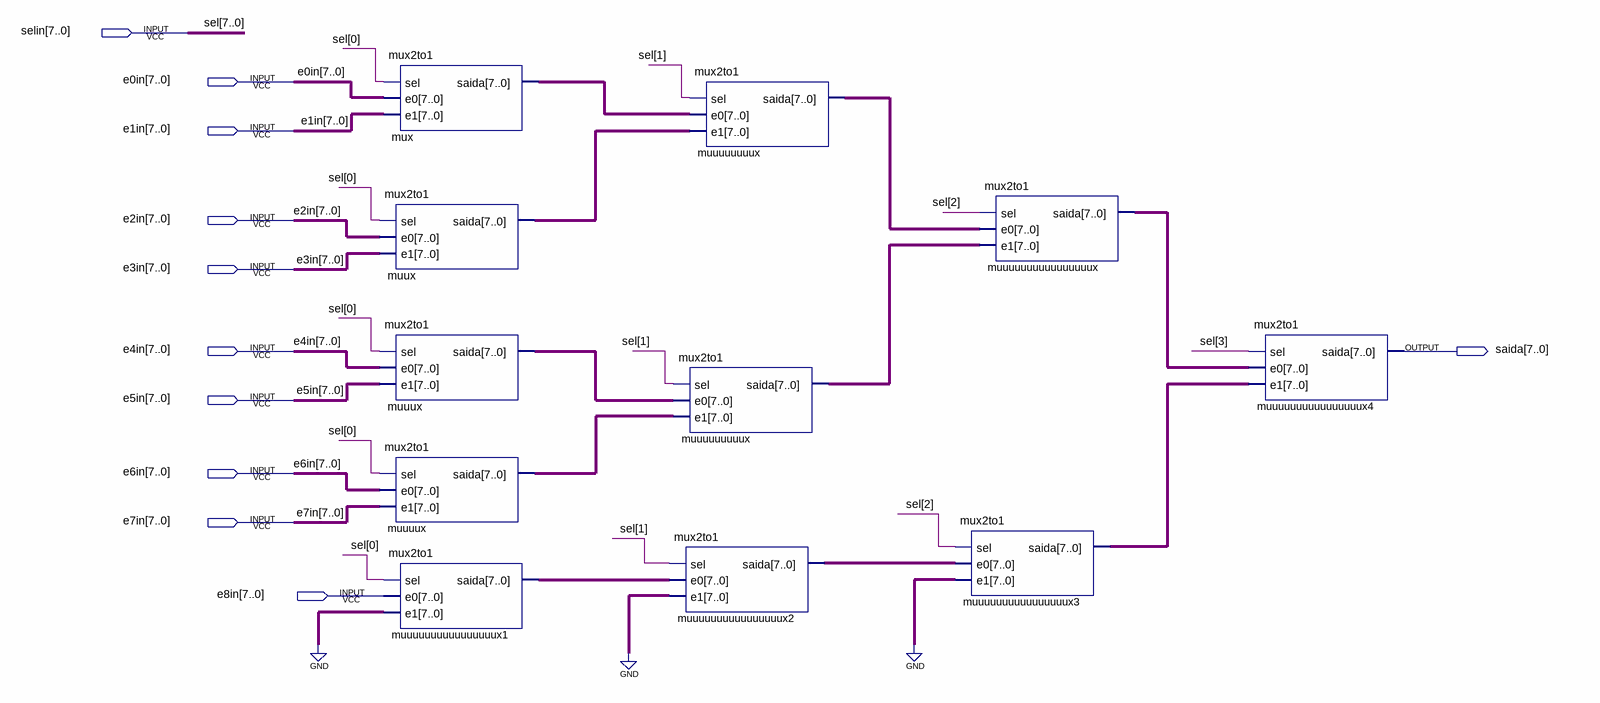
[diagram p0: schematic sheet]
// Quartus schematic memoria.bdf as structural Verilog: 11 symbols, 11 pins
module memoria (
  input  [7:0] selin,
  input  [7:0] e0in,
  input  [7:0] e1in,
  input  [7:0] e2in,
  input  [7:0] e3in,
  input  [7:0] e4in,
  input  [7:0] e5in,
  input  [7:0] e6in,
  input  [7:0] e7in,
  input  [7:0] e8in,
  output [7:0] saida
);

  wire [7:0] muuuuuuuuuuuuuuuux1_saida, muuuuuuuuuuuuuuuux2_saida, muuuuuuuuuuuuuuuux3_saida,
       muuuuuuuuuuuuuuuux_saida, muuuuuuuuux_saida, muuuuuuuux_saida, muuuux_saida, muuux_saida, muux_saida,
       mux_saida;

  mux2to1 mux (.sel(selin[0]), .e0(e0in), .e1(e1in), .saida(mux_saida));
  mux2to1 muux (.sel(selin[0]), .e0(e2in), .e1(e3in), .saida(muux_saida));
  mux2to1 muuux (.sel(selin[0]), .e0(e4in), .e1(e5in), .saida(muuux_saida));
  mux2to1 muuuux (.sel(selin[0]), .e0(e6in), .e1(e7in), .saida(muuuux_saida));
  mux2to1 muuuuuuuuuuuuuuuux1 (.sel(selin[0]), .e0(e8in), .e1({8{1'b0}}), .saida(muuuuuuuuuuuuuuuux1_saida));
  mux2to1 muuuuuuuux (.sel(selin[1]), .e0(mux_saida), .e1(muux_saida), .saida(muuuuuuuux_saida));
  mux2to1 muuuuuuuuux (.sel(selin[1]), .e0(muuux_saida), .e1(muuuux_saida), .saida(muuuuuuuuux_saida));
  mux2to1 muuuuuuuuuuuuuuuux2 (
    .sel(selin[1]), .e0(muuuuuuuuuuuuuuuux1_saida), .e1({8{1'b0}}), .saida(muuuuuuuuuuuuuuuux2_saida));
  mux2to1 muuuuuuuuuuuuuuuux (
    .sel(selin[2]), .e0(muuuuuuuux_saida), .e1(muuuuuuuuux_saida), .saida(muuuuuuuuuuuuuuuux_saida));
  mux2to1 muuuuuuuuuuuuuuuux3 (
    .sel(selin[2]), .e0(muuuuuuuuuuuuuuuux2_saida), .e1({8{1'b0}}), .saida(muuuuuuuuuuuuuuuux3_saida));
  mux2to1 muuuuuuuuuuuuuuuux4 (
    .sel(selin[3]), .e0(muuuuuuuuuuuuuuuux_saida), .e1(muuuuuuuuuuuuuuuux3_saida), .saida(saida));

  // Other names for the same wires on the sheet: sel[7:0] = selin
endmodule
